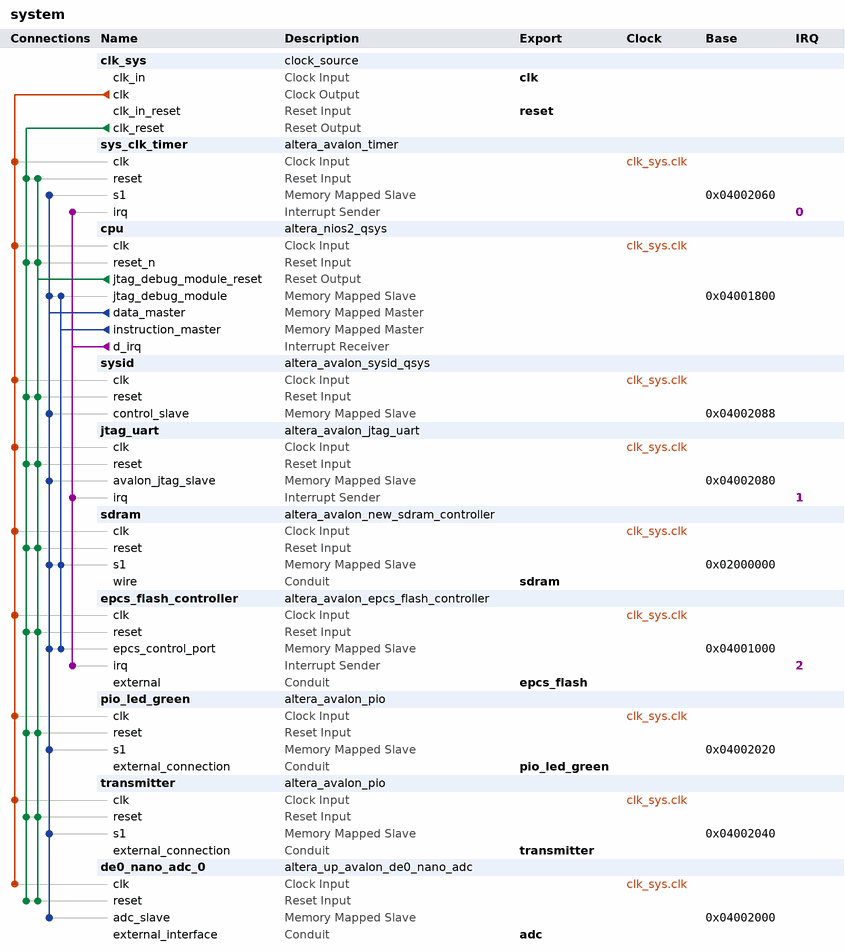
[diagram p0: system contents]
# Platform Designer (Qsys) system system, Cyclone IV E EP4CE22F17C6
# Parameters at their usual value, and those the tool derives, are not listed.
package require -exact qsys 12.1
create_system system
set_project_property DEVICE_FAMILY {Cyclone IV E}
set_project_property DEVICE EP4CE22F17C6

add_instance clk_sys clock_source 12.1
set_instance_parameter_value clk_sys clockFrequency 100000000

add_instance sys_clk_timer altera_avalon_timer 12.1
set_instance_parameter_value sys_clk_timer period 1
set_instance_parameter_value sys_clk_timer periodUnits MSEC
set_instance_parameter_value sys_clk_timer timerPreset CUSTOM

add_instance cpu altera_nios2_qsys 12.1
set_instance_parameter_value cpu resetSlave epcs_flash_controller.epcs_control_port
set_instance_parameter_value cpu exceptionSlave sdram.s1
set_instance_parameter_value cpu breakSlave cpu.jtag_debug_module
set_instance_parameter_value cpu impl Fast
set_instance_parameter_value cpu icache_size 8192
set_instance_parameter_value cpu dcache_size 4096

add_instance sysid altera_avalon_sysid_qsys 12.1
set_instance_parameter_value sysid id 0

add_instance jtag_uart altera_avalon_jtag_uart 12.1
set_instance_parameter_value jtag_uart simInteractiveOptions INTERACTIVE_INPUT_OUTPUT

add_instance sdram altera_avalon_new_sdram_controller 12.1
set_instance_parameter_value sdram TAC 5.5
set_instance_parameter_value sdram TRCD 20.0
set_instance_parameter_value sdram TRP 20.0
set_instance_parameter_value sdram casLatency 3
set_instance_parameter_value sdram columnWidth 9
set_instance_parameter_value sdram dataWidth 16
set_instance_parameter_value sdram generateSimulationModel false
set_instance_parameter_value sdram initRefreshCommands 8
set_instance_parameter_value sdram model custom
set_instance_parameter_value sdram numberOfBanks 4
set_instance_parameter_value sdram numberOfChipSelects 1
set_instance_parameter_value sdram powerUpDelay 200.0
set_instance_parameter_value sdram refreshPeriod 7.8125
set_instance_parameter_value sdram rowWidth 13

add_instance epcs_flash_controller altera_avalon_epcs_flash_controller 12.1

add_instance pio_led_green altera_avalon_pio 12.1
set_instance_parameter_value pio_led_green bitModifyingOutReg true
set_instance_parameter_value pio_led_green direction Output
set_instance_parameter_value pio_led_green width 7

add_instance transmitter altera_avalon_pio 12.1
set_instance_parameter_value transmitter bitModifyingOutReg true
set_instance_parameter_value transmitter direction Output
set_instance_parameter_value transmitter width 4

add_instance de0_nano_adc_0 altera_up_avalon_de0_nano_adc 12.0
set_instance_parameter_value de0_nano_adc_0 sclk_freq 0.8
set_instance_parameter_value de0_nano_adc_0 numch 3

# connections
add_connection clk_sys.clk cpu.clk clock
add_connection clk_sys.clk de0_nano_adc_0.clk clock
add_connection clk_sys.clk epcs_flash_controller.clk clock
add_connection clk_sys.clk jtag_uart.clk clock
add_connection clk_sys.clk pio_led_green.clk clock
add_connection clk_sys.clk sdram.clk clock
add_connection clk_sys.clk sys_clk_timer.clk clock
add_connection clk_sys.clk sysid.clk clock
add_connection clk_sys.clk transmitter.clk clock
add_connection clk_sys.clk_reset cpu.reset_n reset
add_connection clk_sys.clk_reset de0_nano_adc_0.reset reset
add_connection clk_sys.clk_reset epcs_flash_controller.reset reset
add_connection clk_sys.clk_reset jtag_uart.reset reset
add_connection clk_sys.clk_reset pio_led_green.reset reset
add_connection clk_sys.clk_reset sdram.reset reset
add_connection clk_sys.clk_reset sys_clk_timer.reset reset
add_connection clk_sys.clk_reset sysid.reset reset
add_connection clk_sys.clk_reset transmitter.reset reset
add_connection cpu.jtag_debug_module_reset cpu.reset_n reset
add_connection cpu.jtag_debug_module_reset de0_nano_adc_0.reset reset
add_connection cpu.jtag_debug_module_reset epcs_flash_controller.reset reset
add_connection cpu.jtag_debug_module_reset jtag_uart.reset reset
add_connection cpu.jtag_debug_module_reset pio_led_green.reset reset
add_connection cpu.jtag_debug_module_reset sdram.reset reset
add_connection cpu.jtag_debug_module_reset sys_clk_timer.reset reset
add_connection cpu.jtag_debug_module_reset sysid.reset reset
add_connection cpu.jtag_debug_module_reset transmitter.reset reset
add_connection cpu.data_master cpu.jtag_debug_module avalon
set_connection_parameter_value cpu.data_master/cpu.jtag_debug_module baseAddress 0x04001800
add_connection cpu.data_master de0_nano_adc_0.adc_slave avalon
set_connection_parameter_value cpu.data_master/de0_nano_adc_0.adc_slave baseAddress 0x04002000
add_connection cpu.data_master epcs_flash_controller.epcs_control_port avalon
set_connection_parameter_value cpu.data_master/epcs_flash_controller.epcs_control_port baseAddress 0x04001000
add_connection cpu.data_master jtag_uart.avalon_jtag_slave avalon
set_connection_parameter_value cpu.data_master/jtag_uart.avalon_jtag_slave baseAddress 0x04002080
add_connection cpu.data_master pio_led_green.s1 avalon
set_connection_parameter_value cpu.data_master/pio_led_green.s1 baseAddress 0x04002020
add_connection cpu.data_master sdram.s1 avalon
set_connection_parameter_value cpu.data_master/sdram.s1 baseAddress 0x02000000
add_connection cpu.data_master sys_clk_timer.s1 avalon
set_connection_parameter_value cpu.data_master/sys_clk_timer.s1 baseAddress 0x04002060
add_connection cpu.data_master sysid.control_slave avalon
set_connection_parameter_value cpu.data_master/sysid.control_slave baseAddress 0x04002088
add_connection cpu.data_master transmitter.s1 avalon
set_connection_parameter_value cpu.data_master/transmitter.s1 baseAddress 0x04002040
add_connection cpu.instruction_master cpu.jtag_debug_module avalon
set_connection_parameter_value cpu.instruction_master/cpu.jtag_debug_module baseAddress 0x04001800
add_connection cpu.instruction_master epcs_flash_controller.epcs_control_port avalon
set_connection_parameter_value cpu.instruction_master/epcs_flash_controller.epcs_control_port baseAddress 0x04001000
add_connection cpu.instruction_master sdram.s1 avalon
set_connection_parameter_value cpu.instruction_master/sdram.s1 baseAddress 0x02000000
add_connection cpu.d_irq epcs_flash_controller.irq interrupt
set_connection_parameter_value cpu.d_irq/epcs_flash_controller.irq irqNumber 2
add_connection cpu.d_irq jtag_uart.irq interrupt
set_connection_parameter_value cpu.d_irq/jtag_uart.irq irqNumber 1
add_connection cpu.d_irq sys_clk_timer.irq interrupt
set_connection_parameter_value cpu.d_irq/sys_clk_timer.irq irqNumber 0

# exported interfaces
add_interface clk clock sink
set_interface_property clk EXPORT_OF clk_sys.clk_in
add_interface reset reset sink
set_interface_property reset EXPORT_OF clk_sys.clk_in_reset
add_interface sdram conduit end
set_interface_property sdram EXPORT_OF sdram.wire
add_interface transmitter conduit end
set_interface_property transmitter EXPORT_OF transmitter.external_connection
add_interface pio_led_green conduit end
set_interface_property pio_led_green EXPORT_OF pio_led_green.external_connection
add_interface adc conduit end
set_interface_property adc EXPORT_OF de0_nano_adc_0.external_interface
add_interface epcs_flash conduit end
set_interface_property epcs_flash EXPORT_OF epcs_flash_controller.external

save_system system.qsys
